# Altium schematic sheet 03 - Sensors.SchDoc
size A4
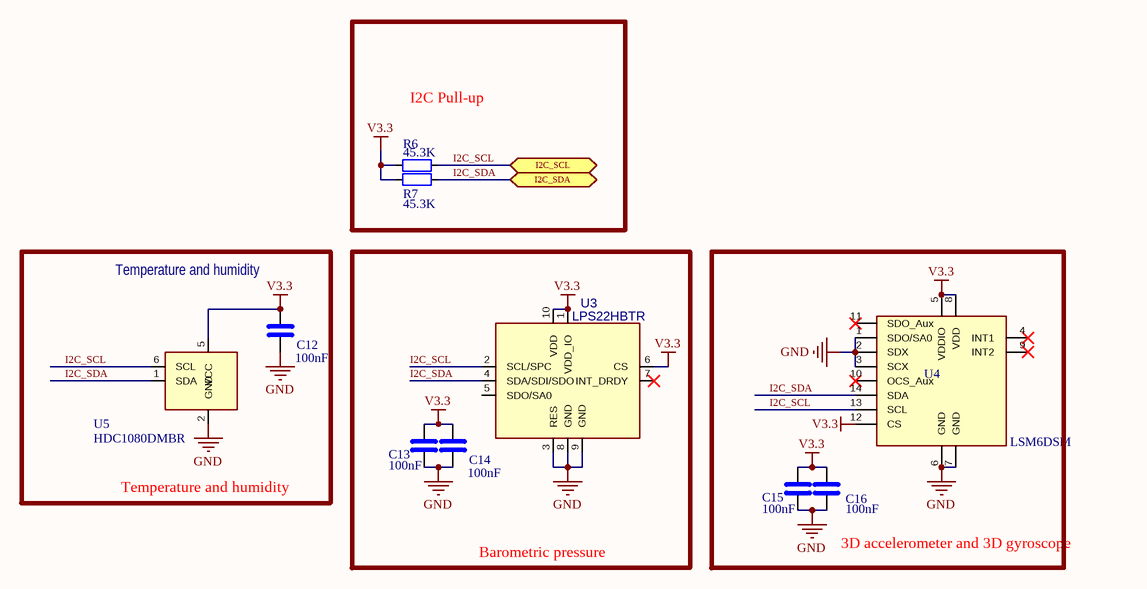
[diagram p0: 03 - Sensors.SchDoc]

## Parts
C12  100nF  [CAP_0603]
C13  100nF  [CAP_0603]
C14  100nF  [CAP_0603]
C15  100nF  [CAP_0603]
C16  100nF  [CAP_0603]
R6  45.3K  [RES_0603]
R7  45.3K  [RES_0603]
U3  value LPS22HBTR  [HLGA10_2X2_STM-L]  (hidden comment: LPS22HH)
U4  LSM6DSM  [LGA-14_3x2.5mm_P0.5mm_LayoutBorder3x4y]
U5  HDC1080DMBR  [Texas_PWSON-N6]

## Blocks framed on the sheet
I2C Pull-up: R6 R7
Barometric pressure: C13 C14 U3
3D accelerometer and 3D gyroscope: C15 C16 U4

## Ports
I2C_SCL (bidir), I2C_SDA (bidir)

## Nets
GND: C12.2 C13.2 C14.2 C15.2 C16.2 U3.3(RES) U3.8(GND) U3.9(GND) U4.1(SDO/SA0) U4.2(SDX) U4.3(SCX) U4.6(GND) U4.7(GND) U5.2(GND)
V3.3: C12.1 C13.1 C14.1 C15.1 C16.1 R6.2 R7.2 U3.1(VDD_IO) U3.6(CS) U3.10(VDD) U4.5(VDDIO) U4.8(VDD) U4.12(CS) U5.5(VCC)
I2C_SCL: R6.1 U3.2(SCL/SPC) U4.13(SCL) U5.6(SCL) ; port I2C_SCL
I2C_SDA: R7.1 U3.4(SDA/SDI/SDO) U4.14(SDA) U5.1(SDA) ; port I2C_SDA

Not connected (* = marked no-connect by the designer): U3 5(SDO/SA0) 7(INT_DRDY)*; U4 4(INT1)* 9(INT2)* 10(OCS_Aux)* 11(SDO_Aux)*; U5 3(NC) 4(NC) 7(DAP)

## Notes on the sheet
- (near C12) Temperature and humidity
- Temperature and humidity
- Title
- Size:
- Date:
- A4
- Number:
- Time:
- Revision:
- Sheet
- of
- File:

## Library data of the parts
C12-C16 = C: pdf: https://www.lcsc.com/datasheet/lcsc_datasheet_2501031500_HRE-CGA0603X7R104K500JT_C6119867.pdf; LCSC PART: C6119867; lcsc link: https://www.lcsc.com/product-detail/Multilayer-Ceramic-Capacitors-MLCC-SMD-SMT_HRE-CGA0603X7R104K500JT_C6119867.html?s_z=n_100nF; JLCPCB: C6119867; Value: 100nF
R6 R7 = R: Value: 45.3K; LCSC PART: C23058; JLCPCB: C23058; lcsc link: https://www.lcsc.com/product-detail/Chip-Resistor-Surface-Mount_UNI-ROYAL-Uniroyal-Elec-0603WAF4532T5E_C23058.html
U3 = LPS22HBTR: 26Kpa~126Kpa HLGA-10(2x2) Pressure Sensors ROHS; LCSC PART: C2827824; Footprint: LPS22HBTR:HLGA10_2X2_STM-L; lcsc link: https://www.lcsc.com/product-detail/Pressure-Sensors_STMicroelectronics-LPS22HHTR_C2827824.html; pdf: https://www.lcsc.com/datasheet/lcsc_datasheet_2209222100_STMicroelectronics-LPS22HHTR_C2827824.pdf; JLCPCB: C2827824
U5 = HDC1080: JLCPCB: C82227; Value: HDC1080DMBR; Footprint: Package_SON:Texas_PWSON-N6; LCSC PART: C82227; lcsc link: https://www.lcsc.com/product-detail/Temperature-and-Humidity-Sensor_Texas-Instruments-HDC1080DMBR_C82227.html?s_z=n_C82227; pdf: https://www.ti.com/lit/ds/symlink/hdc1080.pdf?ts=1737300187160&ref_url=https%253A%252F%252Fwww.google.com%252F
U4 = LSM6DSM: JLCPCB: C94048; Value: LSM6DSM; Footprint: Package_LGA:LGA-14_3x2.5mm_P0.5mm_LayoutBorder3x4y; LCSC PART: C94048; lcsc link: https://www.lcsc.com/product-detail/Accelerometers_STMicroelectronics-LSM6DSMTR_C94048.html?s_z=n_C94048; pdf: https://www.lcsc.com/datasheet/lcsc_datasheet_1811101102_STMicroelectronics-LSM6DSMTR_C94048.pdf